# Altium schematic sheet power.SchDoc
size A4; SheetNumber: 2; SheetTotal: 4
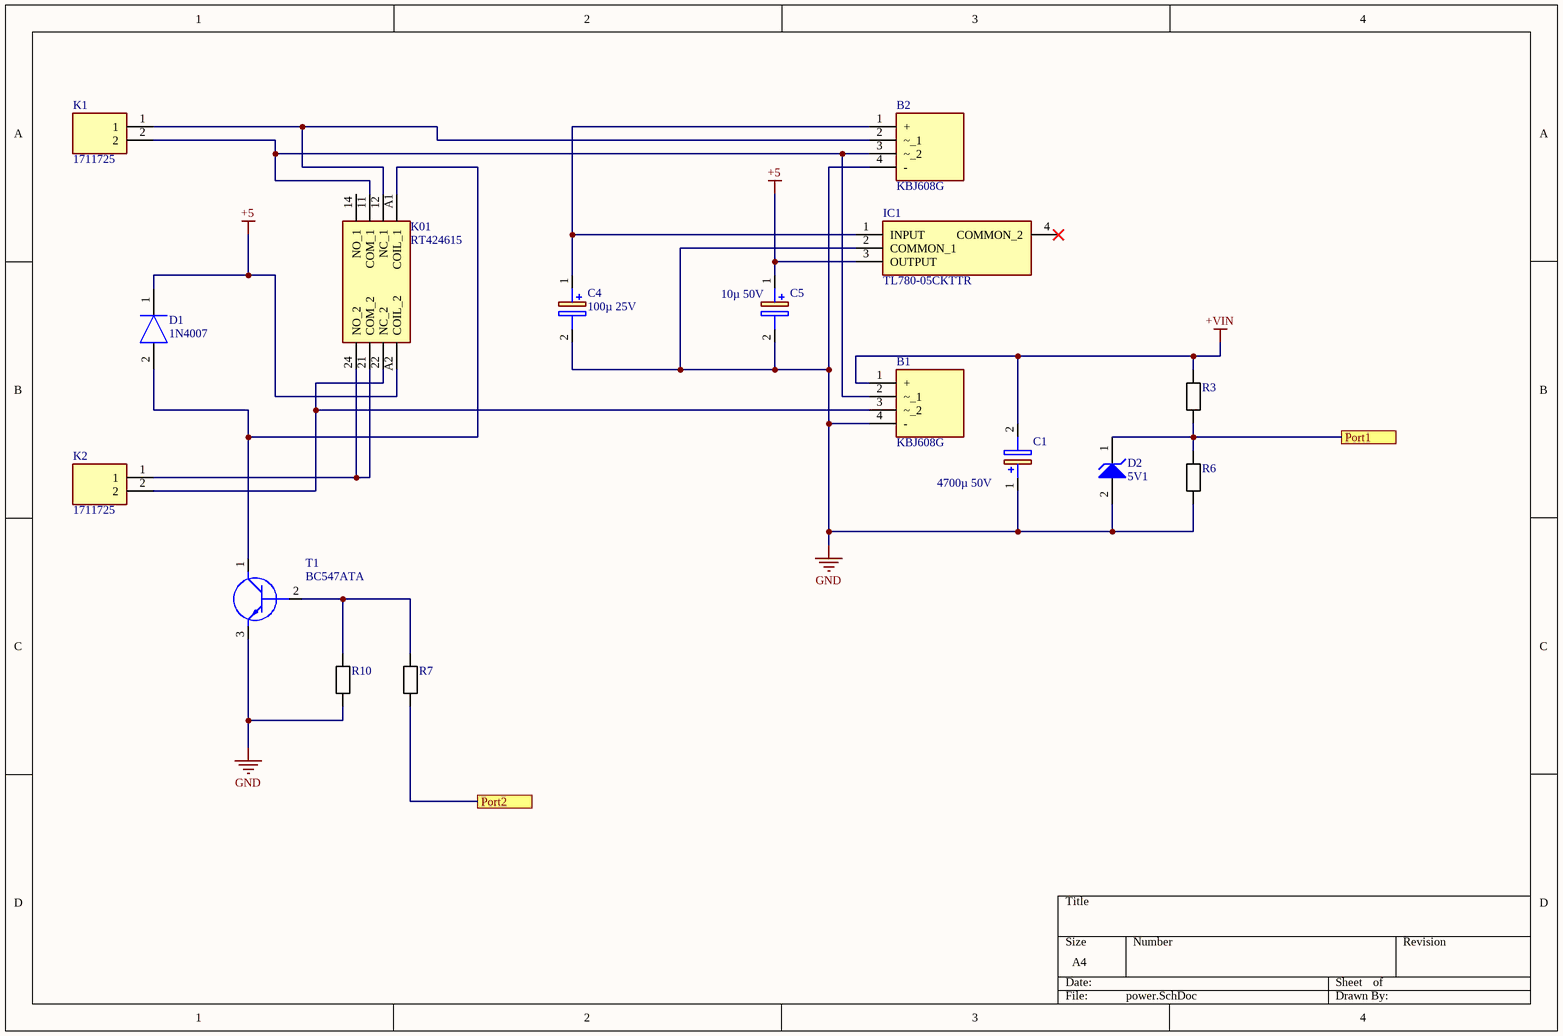
[diagram p0: power.SchDoc]

## Parts
B1  KBJ608G  [TO750P480X2500X1900-4P]
B2  KBJ608G  [TO750P480X2500X1900-4P]
C1  4700µ 50V  [CAPPRD750W82D1800H4300]
C4  100µ 25V  [CAPPRD500W65D1025H1250]
C5  10µ 50V  [CAPPRD500W65D1025H1250]
D1  1N4007  [DIOM5327X242N]
D2  5V1  [LIBRARYSOURCE=Vault]
IC1  TL780-05CKTTR  [TL78005CKTTR]
K1  1711725  [1711725]
K01  RT424615  [RT424615]
K2  1711725  [1711725]
R3  CRCW08050000Z0EA  [RESC2012X65N]  (value not drawn)
R6  CRCW08050000Z0EA  [RESC2012X65N]  (value not drawn)
R7  CRCW08050000Z0EA  [RESC2012X65N]  (value not drawn)
R10  CRCW08050000Z0EA  [RESC2012X65N]  (value not drawn)
T1  BC547ATA  [TO-92_(TO-226)]

## Ports
Port1, Port2

## Nets
+5: C5.1(+) D1.1(K) IC1.3(OUTPUT) K01.A2(COIL_2)
+VIN: B1.1(+) C1.2(-) R3.2
GND: B1.4(-) B2.4(-) C1.1(+) C4.2(-) C5.2(-) D2.2(A) IC1.2(COMMON_1) R6.1 R10.1 T1.3(E)
Port1: D2.1(K) R3.1 R6.2 ; port Port1
Port2: R7.1 ; port Port2
NetB1_2: B1.2(~_1) B2.3(~_2) K1.2 K01.11(COM_1)
NetB1_3: B1.3(~_2) K01.22(NC_2) K2.2
NetB2_1: B2.1(+) C4.1(+) IC1.1(INPUT)
NetB2_2: B2.2(~_1) K1.1 K01.12(NC_1)
NetD1_2: D1.2(A) K01.A1(COIL_1) T1.1(C)
NetK01_21: K01.21(COM_2) K01.24(NO_2) K2.1
NetR7_2: R7.2 R10.2 T1.2(B)

Not connected (* = marked no-connect by the designer): IC1 4(COMMON_2)*; K01 14(NO_1)

## Library data of the parts
B1 B2 = KBJ608G: Bridge Rectifier; Manufacturer_Name: Diodes Inc.; Datasheet Link: https://www.diodes.com/assets/Datasheets/ds21207.pdf; Height: 4.8mm; Manufacturer_Part_Number: KBJ608G; Mouser Part Number: 621-KBJ608G; Mouser Price/Stock: https://www.mouser.co.uk/ProductDetail/Diodes-Incorporated/KBJ608G?qs=zpnZCIghiEzyVG1EfRzSrg%3D%3D; Arrow Part Number: KBJ608G; Arrow Price/Stock: https://www.arrow.com/en/products/kbj608g/diodes-incorporated
C1 = 860010281031: Capacitor Polarised; Manufacturer_Name: Wurth Elektronik; Datasheet Link: https://www.we-online.com/catalog/datasheet/860010281031.pdf; Height: 43mm; Manufacturer_Part_Number: 860010281031; Mouser Part Number: 710-860010281031; Mouser Price/Stock: https://www.mouser.co.uk/ProductDetail/Wurth-Elektronik/860010281031?qs=0KOYDY2FL2%252ByBmP2PfcJMg%3D%3D
C4 C5 = B41851A6227M000: Capacitor Polarised; Manufacturer_Name: TDK; Datasheet Link: https://altium.componentsearchengine.com/Datasheets/1/B41851A6227M000.pdf; Height: 12.5mm; Manufacturer_Part_Number: B41851A6227M000; Mouser Part Number: 871-B41851A6227M000; Mouser Price/Stock: http://www.mouser.com/Search/ProductDetail.aspx?qs=DFkWJ3l%252bHdIsXImfYI6EYQ%3d%3d; Arrow Part Number: B41851A6227M000; Arrow Price/Stock: https://www.arrow.com/en/products/b41851a6227m000/epcos-tdk
D1 = 1N4007: Diode; Manufacturer_Name: Shikues; Datasheet Link: https://datasheet.lcsc.com/szlcsc/SK-1N4007_C126233.pdf; Height: 2.42mm; Manufacturer_Part_Number: 1N4007
D2 = ONSC-K1A2-2: 3 W Zener Voltage Regulator, 2-Pin SMB, Pb-Free, Tape and Reel; Manufacturer: On Semiconductor; PartNumber: 1SMB5920BT3G; VZ Typ (V): 6.2; Packing: Tape and Reel; PackageDescription: 2-Pin Small Molded Package, J-Bend Lead, Body 4.33 x 3.625 mm; Mounting Technology: Surface Mount; PackageVersion: Rev. H, 05/2011; ComponentLink1Description: Manufacturer URL; RoHS: Pb-Free; DatasheetVersion: Rev. 8; ComponentLink2Description: Datasheet; ComponentLink2URL: http://www.onsemi.com/pub_link/Collateral/1SMB5913BT3-D.PDF; ComponentLink1URL: http://www.onsemi.com/; ComponentLink3Description: Package Specification; PackageReference: SMB-2-403A-03_H; ComponentLink3URL: http://www.onsemi.com/pub_link/Collateral/1SMB5913BT3-D.PDF
IC1 = TL780-05CKTTR: Integrated Circuit; Manufacturer_Name: Texas Instruments; Datasheet Link: http://www.ti.com/general/docs/suppproductinfo.tsp?distId=26&gotoUrl=http%3A%2F%2Fwww.ti.com%2Flit%2Fgpn%2Ftl780; Height: 5.08mm; Manufacturer_Part_Number: TL780-05CKTTR; Mouser Part Number: 595-TL780-05CKTTR; Mouser Price/Stock: https://www.mouser.co.uk/ProductDetail/Texas-Instruments/TL780-05CKTTR?qs=7kv20MEVUlhtPP21hgiOlA%3D%3D; Arrow Part Number: TL780-05CKTTR; Arrow Price/Stock: https://www.arrow.com/en/products/tl780-05ckttr/texas-instruments?region=nac
K1 K2 = 1711725: Connector; Manufacturer_Name: Phoenix Contact; Datasheet Link: http://www.phoenixcontact.com/de/produkte/1711725/pdf; Height: 18.2mm; Manufacturer_Part_Number: 1711725; Mouser Part Number: 651-1711725; Mouser Price/Stock: https://www.mouser.co.uk/ProductDetail/Phoenix-Contact/1711725?qs=F79NelsxgYFLEb9U5DotcA%3D%3D; Arrow Part Number: 1711725; Arrow Price/Stock: https://www.arrow.com/en/products/1711725/phoenix-contact?region=nac
K01 = RT424615: Relay or Contactor; Manufacturer_Name: TE Connectivity; Datasheet Link: https://componentsearchengine.com/Datasheets/1/RT424615.pdf; Height: 15.7mm; Manufacturer_Part_Number: RT424615; Mouser Part Number: 655-RT424615; Mouser Price/Stock: https://www.mouser.co.uk/ProductDetail/TE-Connectivity-PB/RT424615?qs=souyeP66LNEWDvmL0hcjYQ%3D%3D; Arrow Part Number: RT424615; Arrow Price/Stock: https://www.arrow.com/en/products/rt424615/te-connectivity?region=nac
R3 R6 R7 R10 = RES: Manufacturer: Vishay Dale; Part Number: CRCW08050000Z0EA
T1 = BC547ATA: Transistor BJT NPN; Manufacturer_Name: ON Semiconductor; Datasheet Link: https://www.onsemi.com/pub/Collateral/BC550-D.pdf; Manufacturer_Part_Number: BC547ATA; Mouser Part Number: 512-BC547ATA; Mouser Price/Stock: https://www.mouser.co.uk/ProductDetail/ON-Semiconductor-Fairchild/BC547ATA?qs=ljbEvF4DwOMRdLfuzO8N4w%3D%3D; Arrow Part Number: BC547ATA; Arrow Price/Stock: https://www.arrow.com/en/products/bc547ata/on-semiconductor?region=europe